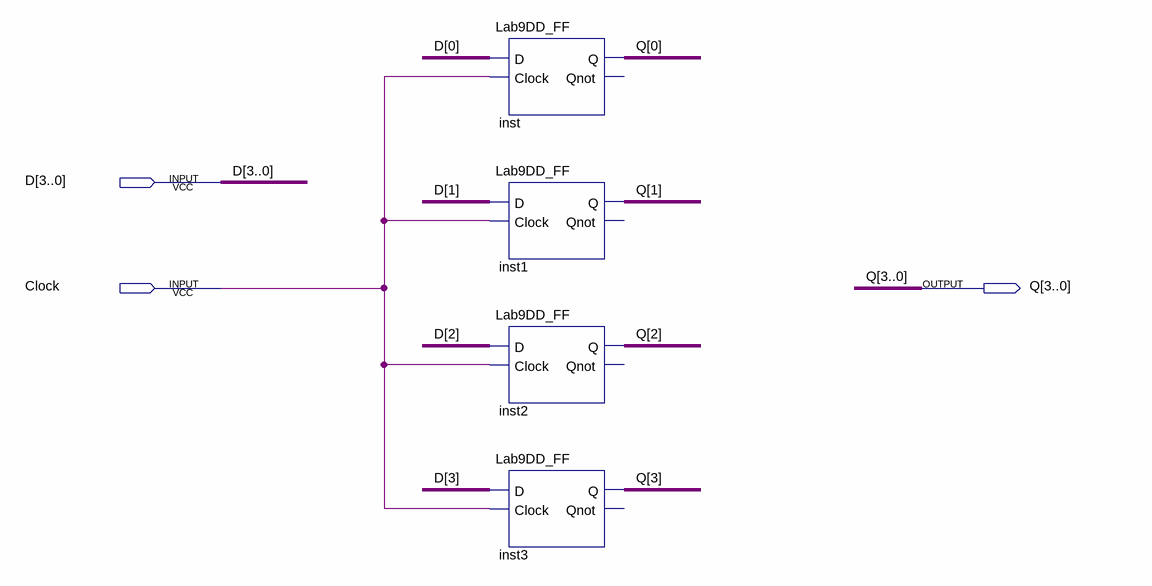
[diagram p0: schematic sheet]
// Quartus schematic Lab9_4BitRegister.bdf as structural Verilog: 4 symbols, 3 pins
module Lab9_4BitRegister (
  input  [3:0] D,
  input  Clock,
  output [3:0] Q
);

  Lab9DD_FF inst (.D(D[0]), .Clock(Clock), .Q(Q[0]));  // open: Qnot
  Lab9DD_FF inst1 (.D(D[1]), .Clock(Clock), .Q(Q[1]));  // open: Qnot
  Lab9DD_FF inst2 (.D(D[2]), .Clock(Clock), .Q(Q[2]));  // open: Qnot
  Lab9DD_FF inst3 (.D(D[3]), .Clock(Clock), .Q(Q[3]));  // open: Qnot
endmodule
